# Altium schematic sheet Main.SchDoc: LEDDRV_MCU
size A4; SheetNumber: 2; SheetTotal: 3
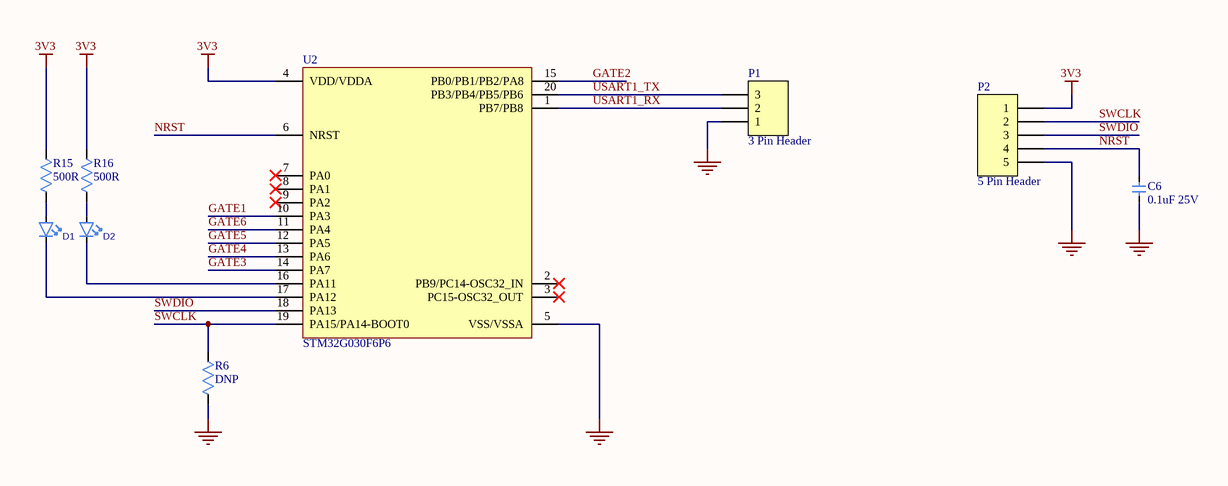
[diagram p0: Main.SchDoc]

## Parts
C6  0.1uF 25V  [CAP 0402_1005]
D1  BLU  [LED-0603-BLUE]  (value not drawn)
D2  BLU  [LED-0603-BLUE]  (value not drawn)
P1  3 Pin Header  [PCB - CONNECTOR - HEADER PIN 03]
P2  5 Pin Header  [PCB - CONNECTOR - HEADER PIN 05]  (no BOM)
R6  DNP  [RES 0402_1005]
R15  500R  [RES 0402_1005]
R16  500R  [RES 0402_1005]
U2  STM32G030F6P6  [STM32 - TSSOP20]

## Nets
3V3: P2.1 R15.1 R16.1 U2.4(VDD/VDDA)
GND: C6.1 P1.1 P2.5 R6.1 U2.5(VSS/VSSA)
GATE1: U2.10(PA3)
GATE2: U2.15(PB0/PB1/PB2/PA8)
GATE3: U2.14(PA7)
GATE4: U2.13(PA6)
GATE5: U2.12(PA5)
GATE6: U2.11(PA4)
NRST: C6.2 P2.4 U2.6(NRST)
SWCLK: P2.2 R6.2 U2.19(PA15/PA14-BOOT0)
SWDIO: P2.3 U2.18(PA13)
USART1_RX: P1.2 U2.1(PB7/PB8)
USART1_TX: P1.3 U2.20(PB3/PB4/PB5/PB6)
NetD1_A: D1.A R15.2
NetD1_K: D1.K U2.17(PA12)
NetD2_A: D2.A R16.2
NetD2_K: D2.K U2.16(PA11)

Not connected (* = marked no-connect by the designer): U2 2(PB9/PC14-OSC32_IN)* 3(PC15-OSC32_OUT)* 7(PA0)* 8(PA1)* 9(PA2)*

## Notes on the sheet
- Title
- Number:
- Date:
- Revision:
- Sheet
- of
- Author
- Security
- Doc Size
- A4
- File:

## Library data of the parts
C6 = Capacitor: SMT Capacitor; Value: 0.1uF 25V
D1 D2 = LED_BLUE: CHIP LED BLUE; Part Number: LG L29K Smartled Green; Manufacturer: Multicomp; Manufacturer Part Number: LG L29K-G2J1-24-Z; Value: L0603G; Note: 2,24..5.6 mcd, Vfmin=1.7V; Artikkelnr Noca: N.A.; Datasheet: http://www.osram-os.com/Graphics/XPic2/00077107_0.pdf; Footprint Doc: 0603; LatestRevisionDate: 2014-10-28; Pin Count: 2; Publisher: Nordic Semiconductor; Published: 2014-10-28; Supplier: Digi-Key; Supplier part number: 475-2709-1-ND; 2nd source Supplier: *; 2nd source part number: *; Artikkelnr Simpro: N.A.
R6 R15 R16 = Resistor: SMT Resistor
  R6: Value: DNP
  R15 R16: Value: 500R
U2 = STM32G030F6P6: No Description Available; Full Part Number: STM32G030F6P6
P1 = 3 Pin Header: Value: 3 Pin Header
P2 = 5 Pin Header: Value: 5 Pin Header